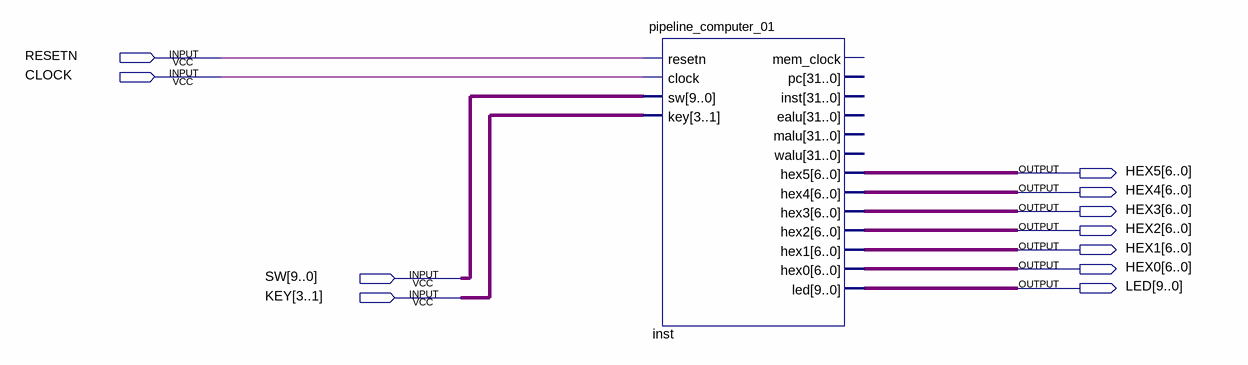
[diagram p0: schematic sheet]
// Quartus schematic pipeline_computer.bdf as structural Verilog: 1 symbols, 11 pins
module pipeline_computer (
  input  RESETN,
  input  CLOCK,
  input  [9:0] SW,
  input  [3:1] KEY,
  output [6:0] HEX5,
  output [6:0] HEX4,
  output [6:0] HEX3,
  output [6:0] HEX2,
  output [6:0] HEX1,
  output [6:0] HEX0,
  output [9:0] LED
);

  pipeline_computer_01 inst (
    .resetn(RESETN), .clock(CLOCK), .sw(SW), .key(KEY), .hex5(HEX5), .hex4(HEX4), .hex3(HEX3), .hex2(HEX2),
    .hex1(HEX1), .hex0(HEX0), .led(LED));  // open: mem_clock, pc, inst, ealu, malu, walu
endmodule
